# EAGLE design brushless (EAGLE 6.1)

## Sheet 1 of 4
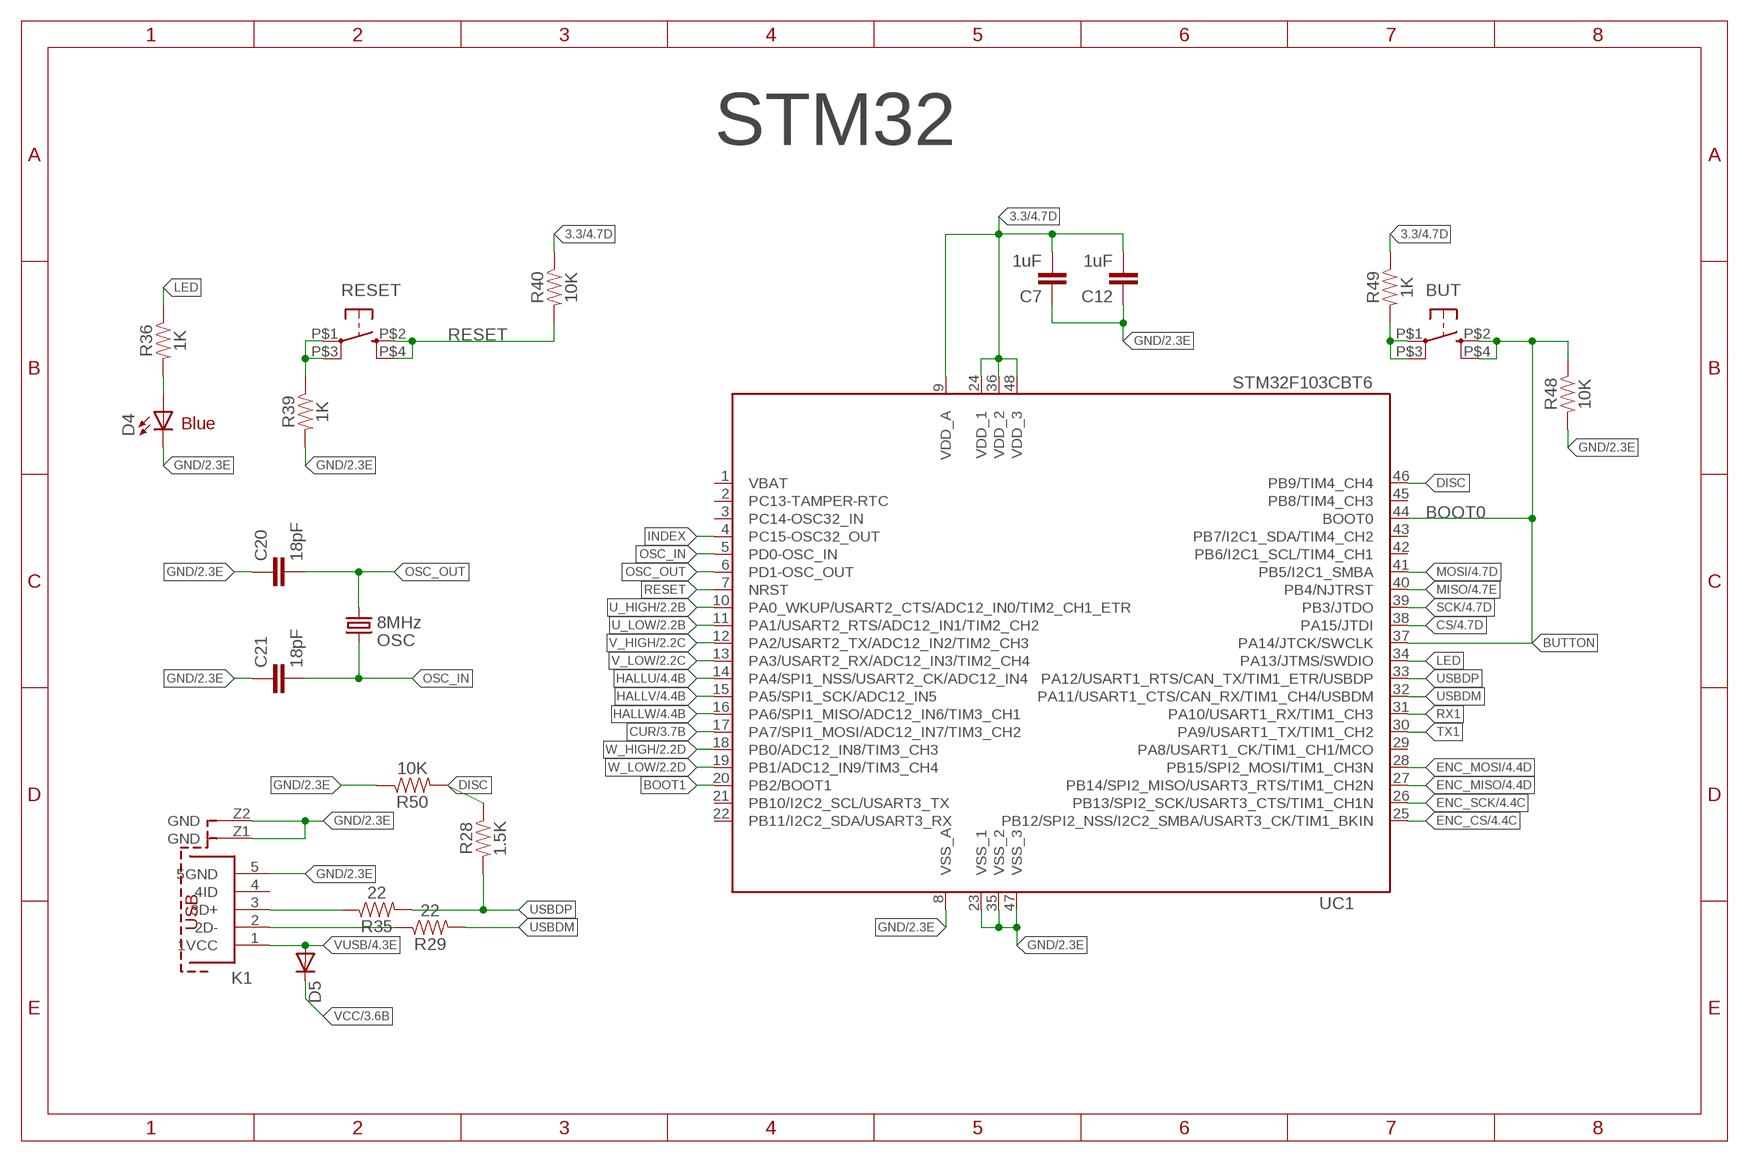
[diagram p0: schematic, sheet 1]

### Parts
BUT  KMR211GLFS  BUTTON-KMR241GLFS  [PUSHBUTTON-KMR241GLFS]
C7  1uF  CAP0805  [0805@1]
C12  1uF  CAP0805  [0805@1]
C20  18pF  CAP0805  [0805@1]
C21  18pF  CAP0805  [0805@1]
D4  Blue  LED1206  [LED-1206]
D5  DIODESOD  [SOD-323]
K1  614105150721  [614105150721]
OSC  8MHz  CRYSTAL5X3  [CRYSTAL-SMD-5X3]
R28  1.5K  RESISTOR0805  [0805]
R29  22  RESISTOR0805  [0805]
R35  22  RESISTOR0805  [0805]
R36  1K  RESISTOR0805  [0805]
R39  1K  RESISTOR0805  [0805]
R40  10K  RESISTOR0805  [0805]
R48  10K  RESISTOR0805  [0805]
R49  1K  RESISTOR0805  [0805]
R50  10K  RESISTOR0805  [0805]
RESET  KMR211GLFS  BUTTON-KMR241GLFS  [PUSHBUTTON-KMR241GLFS]
UC1  STM32F103CBT6  STM32_STM32F103CB  [STM32_LQFP48]

### Nets
3.3: C7.2 C12.2 R40.1 R49.1 UC1.9(VDD_A) UC1.24(VDD_1) UC1.36(VDD_2) UC1.48(VDD_3) ; also sheet 4
BOOT1: UC1.20(PB2/BOOT1)
BUTTON: BUT.P$2 BUT.P$4 R48.1 UC1.37(PA14/JTCK/SWCLK) UC1.44(BOOT0)
CS: UC1.38(PA15/JTDI) ; also sheet 4
CUR: UC1.17(PA7/SPI1_MOSI/ADC12_IN7/TIM3_CH2) ; also sheet 3
DISC: R28.1 R50.2 UC1.46(PB9/TIM4_CH4)
ENC_CS: UC1.25(PB12/SPI2_NSS/I2C2_SMBA/USART3_CK/TIM1_BKIN) ; also sheet 4
ENC_MISO: UC1.27(PB14/SPI2_MISO/USART3_RTS/TIM1_CH2N) ; also sheet 4
ENC_MOSI: UC1.28(PB15/SPI2_MOSI/TIM1_CH3N) ; also sheet 4
ENC_SCK: UC1.26(PB13/SPI2_SCK/USART3_CTS/TIM1_CH1N) ; also sheet 4
GND [power]: C7.1 C12.1 C20.1 C21.1 D4.C K1.5(5GND) K1.Z1(GND) K1.Z2(GND) R39.2 R48.2 R50.1 UC1.8(VSS_A) UC1.23(VSS_1) UC1.35(VSS_2) UC1.47(VSS_3) ; also sheet 2,3,4
HALLU: UC1.14(PA4/SPI1_NSS/USART2_CK/ADC12_IN4) ; also sheet 4
HALLV: UC1.15(PA5/SPI1_SCK/ADC12_IN5) ; also sheet 4
HALLW: UC1.16(PA6/SPI1_MISO/ADC12_IN6/TIM3_CH1) ; also sheet 4
INDEX: UC1.4(PC15-OSC32_OUT)
LED: R36.1 UC1.34(PA13/JTMS/SWDIO)
MISO: UC1.40(PB4/NJTRST) ; also sheet 4
MOSI: UC1.41(PB5/I2C1_SMBA) ; also sheet 4
N$19: R39.1 RESET.P$1 RESET.P$3
N$26: BUT.P$1 BUT.P$3 R49.2
N$29: D4.A R36.2
N$59: K1.2(2D-) R29.1
N$60: K1.3(3D+) R35.1
OSC_IN: C21.2 OSC.3 UC1.5(PD0-OSC_IN)
OSC_OUT: C20.2 OSC.1 UC1.6(PD1-OSC_OUT)
RESET: R40.2 RESET.P$2 RESET.P$4 UC1.7(NRST)
RX1: UC1.31(PA10/USART1_RX/TIM1_CH3)
SCK: UC1.39(PB3/JTDO) ; also sheet 4
TX1: UC1.30(PA9/USART1_TX/TIM1_CH2)
U_HIGH: UC1.10(PA0_WKUP/USART2_CTS/ADC12_IN0/TIM2_CH1_ETR) ; also sheet 2
U_LOW: UC1.11(PA1/USART2_RTS/ADC12_IN1/TIM2_CH2) ; also sheet 2
USBDM: R29.2 UC1.32(PA11/USART1_CTS/CAN_RX/TIM1_CH4/USBDM)
USBDP: R28.2 R35.2 UC1.33(PA12/USART1_RTS/CAN_TX/TIM1_ETR/USBDP)
V_HIGH: UC1.12(PA2/USART2_TX/ADC12_IN2/TIM2_CH3) ; also sheet 2
V_LOW: UC1.13(PA3/USART2_RX/ADC12_IN3/TIM2_CH4) ; also sheet 2
VCC: D5.1(C) ; also sheet 3,4
VUSB: D5.2(A) K1.1(1VCC) ; also sheet 4
W_HIGH: UC1.18(PB0/ADC12_IN8/TIM3_CH3) ; also sheet 2
W_LOW: UC1.19(PB1/ADC12_IN9/TIM3_CH4) ; also sheet 2
Unconnected: K1.4(4ID) UC1.2(PC13-TAMPER-RTC) UC1.3(PC14-OSC32_IN) UC1.21(PB10/I2C2_SCL/USART3_TX) UC1.22(PB11/I2C2_SDA/USART3_RX) UC1.29(PA8/USART1_CK/TIM1_CH1/MCO) UC1.42(PB6/I2C1_SCL/TIM4_CH1) UC1.43(PB7/I2C1_SDA/TIM4_CH2) UC1.45(PB8/TIM4_CH3)

### Notes on the sheet
- STM32
- Blue
- BOOT0

## Sheet 2 of 4
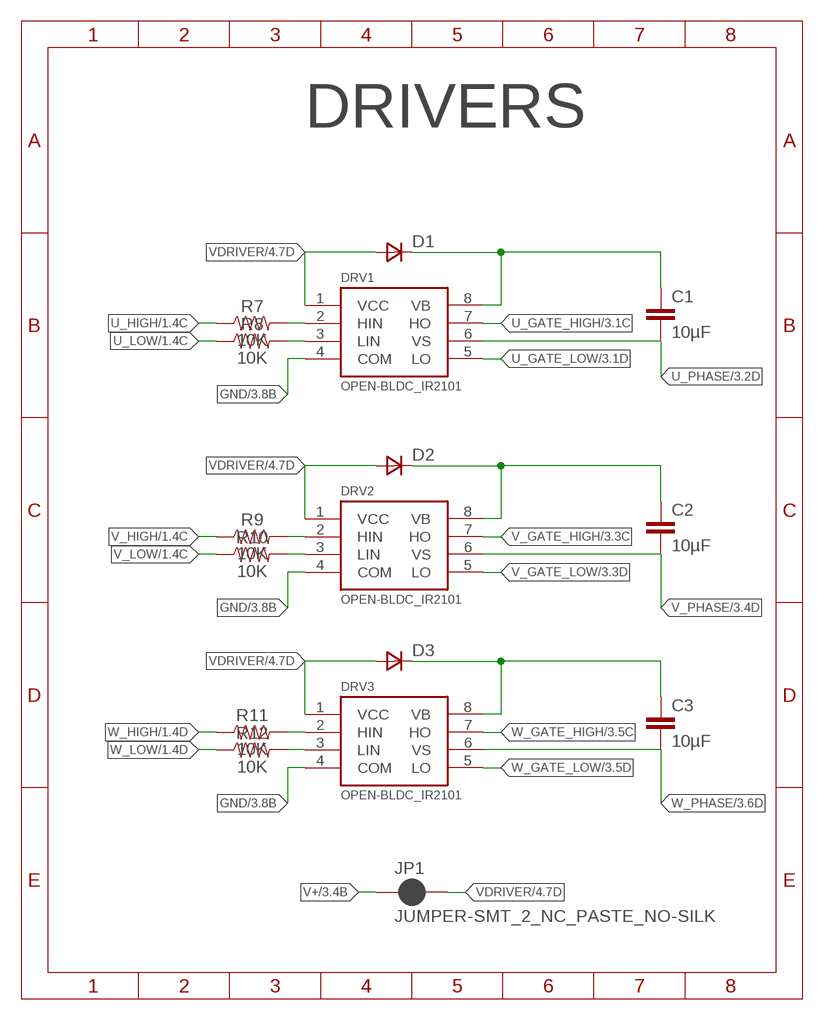
[diagram p1: schematic, sheet 2]

### Parts
C1  10µF  0.33UF/330NF-0805-50V-10%  [0805]
C2  10µF  0.33UF/330NF-0805-50V-10%  [0805]
C3  10µF  0.33UF/330NF-0805-50V-10%  [0805]
D1  ZETEX_VAR2SOT23  [ZETEX_SOT-23]
D2  ZETEX_VAR2SOT23  [ZETEX_SOT-23]
D3  ZETEX_VAR2SOT23  [ZETEX_SOT-23]
DRV1  OPEN-BLDC_IR2101  [OPEN-BLDC_SO-8]
DRV2  OPEN-BLDC_IR2101  [OPEN-BLDC_SO-8]
DRV3  OPEN-BLDC_IR2101  [OPEN-BLDC_SO-8]
JP1  JUMPER-SMT_2_NC_PASTE_NO-SILK  [SMT-JUMPER_2_NC_PASTE_NO-SILK]
R7  10K  RESISTOR0805  [0805]
R8  10K  RESISTOR0805  [0805]
R9  10K  RESISTOR0805  [0805]
R10  10K  RESISTOR0805  [0805]
R11  10K  RESISTOR0805  [0805]
R12  10K  RESISTOR0805  [0805]

### Nets
GND [power]: DRV1.4(COM) DRV2.4(COM) DRV3.4(COM) ; also sheet 1,3,4
N$4: DRV1.2(HIN) R7.2
N$5: C1.1 D1.1(C) DRV1.8(VB)
N$8: DRV1.3(LIN) R8.2
N$10: C2.1 D2.1(C) DRV2.8(VB)
N$12: DRV2.2(HIN) R9.2
N$13: DRV2.3(LIN) R10.2
N$15: C3.1 D3.1(C) DRV3.8(VB)
N$16: DRV3.2(HIN) R11.2
N$17: DRV3.3(LIN) R12.2
U_GATE_HIGH: DRV1.7(HO) ; also sheet 3
U_GATE_LOW: DRV1.5(LO) ; also sheet 3
U_HIGH: R7.1 ; also sheet 1
U_LOW: R8.1 ; also sheet 1
U_PHASE [power]: C1.2 DRV1.6(VS) ; also sheet 3,4
V+ [vdriver]: JP1.1 ; also sheet 3,4
V_GATE_HIGH: DRV2.7(HO) ; also sheet 3
V_GATE_LOW: DRV2.5(LO) ; also sheet 3
V_HIGH: R9.1 ; also sheet 1
V_LOW: R10.1 ; also sheet 1
V_PHASE [power]: C2.2 DRV2.6(VS) ; also sheet 3,4
VDRIVER [vdriver]: D1.3(A) D2.3(A) D3.3(A) DRV1.1(VCC) DRV2.1(VCC) DRV3.1(VCC) JP1.2 ; also sheet 4
W_GATE_HIGH: DRV3.7(HO) ; also sheet 3
W_GATE_LOW: DRV3.5(LO) ; also sheet 3
W_HIGH: R11.1 ; also sheet 1
W_LOW: R12.1 ; also sheet 1
W_PHASE [power]: C3.2 DRV3.6(VS) ; also sheet 3,4

### Notes on the sheet
- DRIVERS

## Sheet 3 of 4
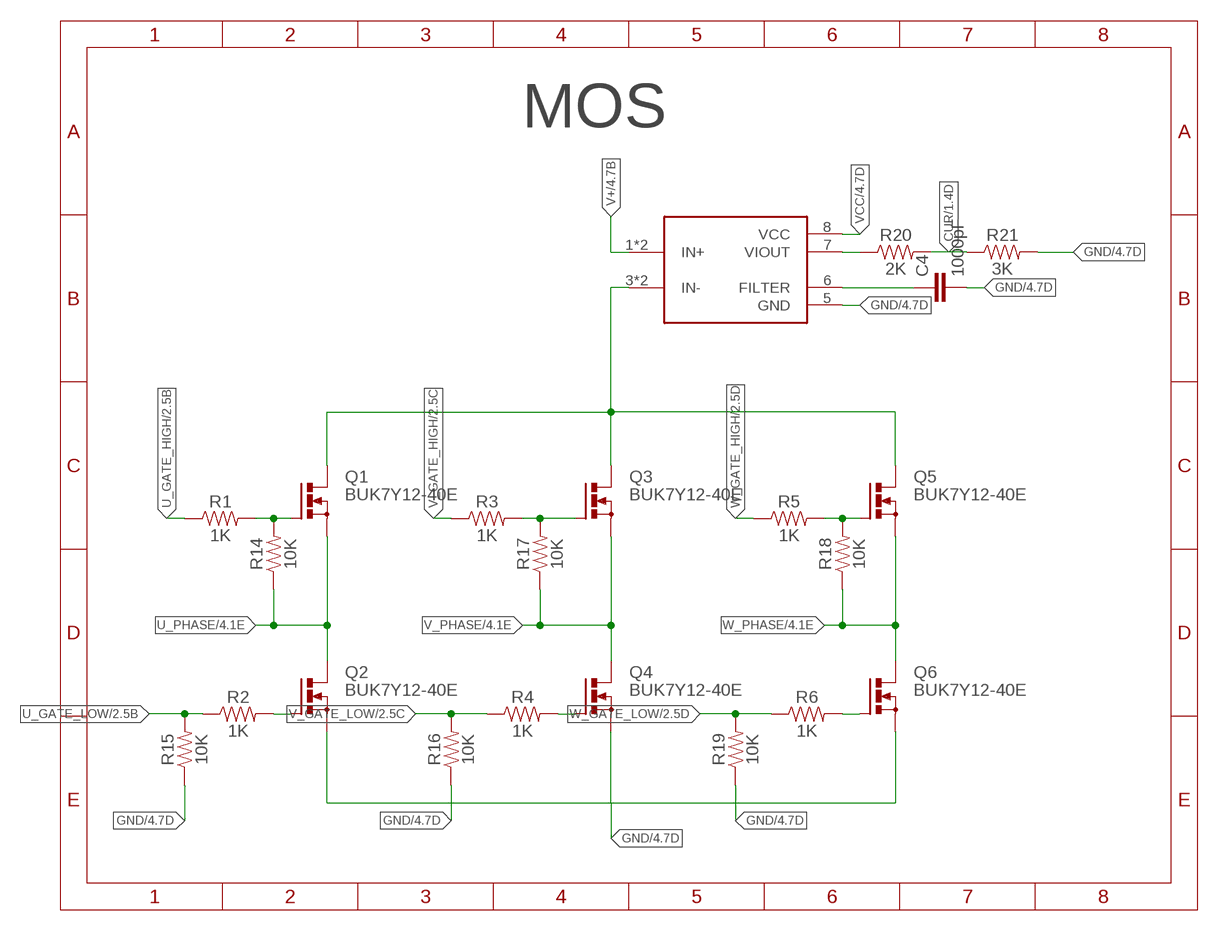
[diagram p2: schematic, sheet 3]

### Parts
C4  1000pF  CAP0805  [0805@1]
Q1  BUK7Y12-40E  [SOT669]
Q2  BUK7Y12-40E  [SOT669]
Q3  BUK7Y12-40E  [SOT669]
Q4  BUK7Y12-40E  [SOT669]
Q5  BUK7Y12-40E  [SOT669]
Q6  BUK7Y12-40E  [SOT669]
R1  1K  RESISTOR0805  [0805]
R2  1K  RESISTOR0805  [0805]
R3  1K  RESISTOR0805  [0805]
R4  1K  RESISTOR0805  [0805]
R5  1K  RESISTOR0805  [0805]
R6  1K  RESISTOR0805  [0805]
R14  10K  RESISTOR0805  [0805]
R15  10K  RESISTOR0805  [0805]
R16  10K  RESISTOR0805  [0805]
R17  10K  RESISTOR0805  [0805]
R18  10K  RESISTOR0805  [0805]
R19  10K  RESISTOR0805  [0805]
R20  2K  RESISTOR0805  [0805]
R21  3K  RESISTOR0805  [0805]
SENSE  ACS712  [SO8]

### Nets
CUR: R20.2 R21.1 ; also sheet 1
GND [power]: C4.2 Q2.1(S) Q2.2(S) Q2.3(S) Q4.1(S) Q4.2(S) Q4.3(S) Q6.1(S) Q6.2(S) Q6.3(S) R15.1 R16.1 R19.1 R21.2 SENSE.5(GND) ; also sheet 1,2,4
N$1: Q1.4(G) R1.2 R14.2
N$2: Q3.4(G) R3.2 R17.2
N$3: Q2.4(G) R2.2
N$6: Q4.4(G) R4.2
N$7: Q5.4(G) R5.2 R18.2
N$9: Q6.4(G) R6.2
N$24: R20.1 SENSE.7(VIOUT)
N$27: C4.1 SENSE.6(FILTER)
U_GATE_HIGH: R1.1 ; also sheet 2
U_GATE_LOW: R2.1 R15.2 ; also sheet 2
U_PHASE [power]: Q1.1(S) Q1.2(S) Q1.3(S) Q2.MB(D) R14.1 ; also sheet 2,4
V+ [vdriver]: SENSE.1(IN+) SENSE.2(IN+) ; also sheet 2,4
V+_MOS [power]: Q1.MB(D) Q3.MB(D) Q5.MB(D) SENSE.3(IN-) SENSE.4(IN-)
V_GATE_HIGH: R3.1 ; also sheet 2
V_GATE_LOW: R4.1 R16.2 ; also sheet 2
V_PHASE [power]: Q3.1(S) Q3.2(S) Q3.3(S) Q4.MB(D) R17.1 ; also sheet 2,4
VCC: SENSE.8(VCC) ; also sheet 1,4
W_GATE_HIGH: R5.1 ; also sheet 2
W_GATE_LOW: R6.1 R19.2 ; also sheet 2
W_PHASE [power]: Q5.1(S) Q5.2(S) Q5.3(S) Q6.MB(D) R18.1 ; also sheet 2,4

### Notes on the sheet
- MOS

## Sheet 4 of 4
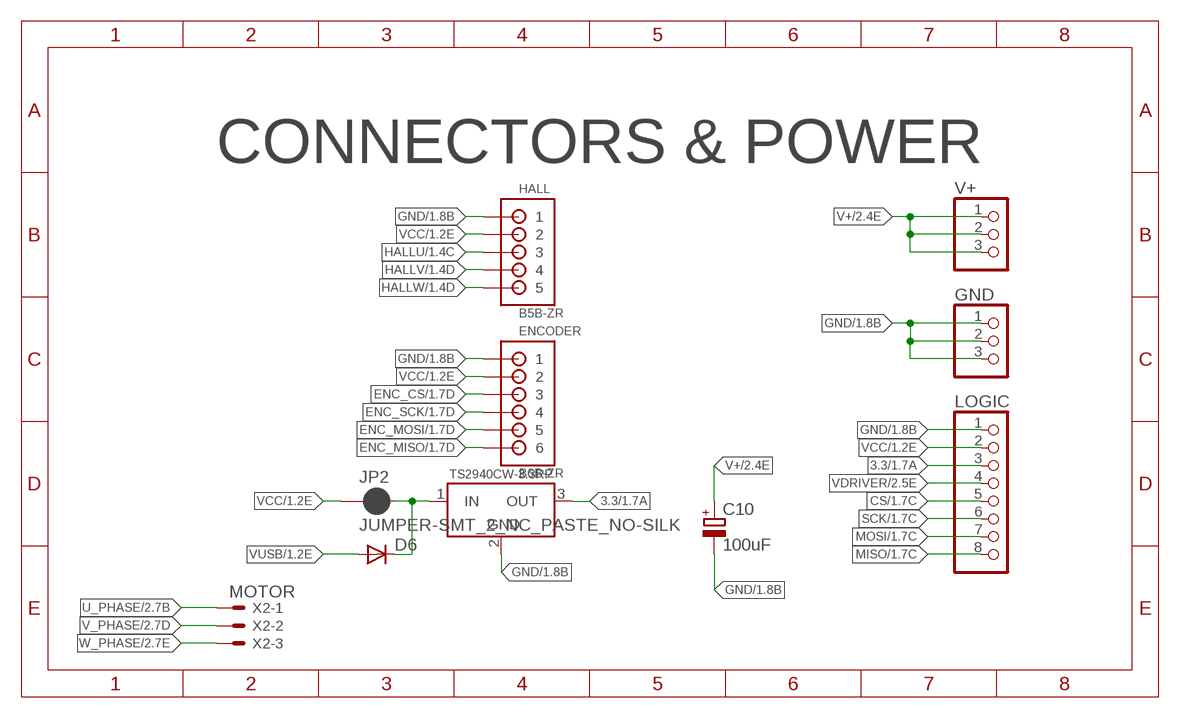
[diagram p3: schematic, sheet 4]

### Parts
C10  100uF  CPOL_EU_3.5-8  [E3,5-8]
D6  DIODESOD  [SOD-323]
ENCODER  B6B-ZR  [B6B-ZR]
GND  CONNEC_1X03  [CONNEC_1X03]
HALL  B5B-ZR  [B5B-ZR]
JP2  JUMPER-SMT_2_NC_PASTE_NO-SILK  [SMT-JUMPER_2_NC_PASTE_NO-SILK]
LOGIC  CONNEC_1X08  [CONNEC_1X08]
REG1  TS2940CW-3.3RP  [SOT223]
V+  CONNEC_1X03  [CONNEC_1X03]
X2  MOTOR  JST-XH-03-PIN-LONG-PAD  [JST-XH-03-PACKAGE-LONG-PAD]

### Nets
3.3: LOGIC.3 REG1.3(OUT) ; also sheet 1
CS: LOGIC.5 ; also sheet 1
ENC_CS: ENCODER.3 ; also sheet 1
ENC_MISO: ENCODER.6 ; also sheet 1
ENC_MOSI: ENCODER.5 ; also sheet 1
ENC_SCK: ENCODER.4 ; also sheet 1
GND [power]: C10.- ENCODER.1 GND.1 GND.2 GND.3 HALL.1 LOGIC.1 REG1.2(GND) ; also sheet 1,2,3
HALLU: HALL.3 ; also sheet 1
HALLV: HALL.4 ; also sheet 1
HALLW: HALL.5 ; also sheet 1
MISO: LOGIC.8 ; also sheet 1
MOSI: LOGIC.7 ; also sheet 1
N$22: D6.1(C) JP2.2 REG1.1(IN)
SCK: LOGIC.6 ; also sheet 1
U_PHASE [power]: X2.1 ; also sheet 2,3
V+ [vdriver]: C10.+ V+.1 V+.2 V+.3 ; also sheet 2,3
V_PHASE [power]: X2.2 ; also sheet 2,3
VCC: ENCODER.2 HALL.2 JP2.1 LOGIC.2 ; also sheet 1,3
VDRIVER [vdriver]: LOGIC.4 ; also sheet 2
VUSB: D6.2(A) ; also sheet 1
W_PHASE [power]: X2.3 ; also sheet 2,3

### Notes on the sheet
- CONNECTORS & POWER

## Power pins joined to a net without a drawn wire
VBAT: UC1.1(VBAT)

## Library data of the parts
BUT RESET = okie:BUTTON-KMR241GLFS; FARNELL: 1437637
C1-C3 = SparkFun-Capacitors:0.33UF/330NF: 0.33µF/330nF ceramic capacitors A capacitor is a passive two-terminal electrical component used to store electrical energy temporarily in an electric field.; FARNELL: 2528772; PROD_ID: CAP-08469; VALUE: 0.33µF
C4 = SparkFun-Passives:CAP: Capacitor Standard 0603 ceramic capacitor, and 0.1" leaded capacitor.; FARNELL: 2496935
C7 C12 = SparkFun-Passives:CAP: Capacitor Standard 0603 ceramic capacitor, and 0.1" leaded capacitor.; FARNELL: 2496946
C10 = rhoban:CPOL_EU: 47uF: http://fr.farnell.com/panasonic-electronic-components/eee1ca470sp/condensateur-elec-alu-47uf-16v/dp/9696946 220uF: http://fr.farnell.com/panasonic-electronic-components/eeefk1c221xp/condensateur-elec-alu-220uf-16v/dp/1850103; FARNELL: 1870964
C20 C21 = SparkFun-Passives:CAP: Capacitor Standard 0603 ceramic capacitor, and 0.1" leaded capacitor.; FARNELL: 1414620
D1-D3 = rhoban:ZETEX_VAR2SOT23: DIODE; FARNELL: 2317446
D4 = SparkFun:LED: LEDs Standard schematic elements and footprints for 5mm, 3mm, 1206, and 0603 sized LEDs. 5mm - Spark Fun Electronics SKU : COM-00529 (and others); FARNELL: 1581233
D5 D6 = SparkFun-DiscreteSemi:DIODE: Diode These are standard reverse protection diodes and small signal diodes. SMA package can handle up to about 1A. SOD-323 can handle about 200mA. What the SOD-323 package when ordering, there are some mfgs out there that are 5-pin packages.; FARNELL: 8737843RL
DRV1-DRV3 = rhoban:OPEN-BLDC_IR2101; FARNELL: 8638730
ENCODER = jst:B6B-ZR: JST-ZH Connector 6 pol, 1.5mm pitch Package: B6B-ZR Source: http://www.jst-mfg.com/product/pdf/eng/eZH.pdf; FARNELL: -
GND V+ = rhoban:CONNEC_1X03; FARNELL: 1022248
HALL = jst:B5B-ZR: JST-ZH Connector 5 pol, 1.5mm pitch Package: B5B-ZR Source: http://www.jst-mfg.com/product/pdf/eng/eZH.pdf; FARNELL: -
JP1 JP2 = SparkFun-Jumpers:JUMPER-SMT_2_NC_PASTE: Normally closed solder jumper This jumper has an aperture in the stencil to allow solder paste to bridge the split in the wire so it's normally closed (NC). Wick off the solder to open the connection. Reapply solder to reclose the connection.; FARNELL: -
K1 = rhoban:614105150721: WR-COM_USB_Micro Type B_Vertical_THT; Micro Type B Vertical THT- Tape & Reel not for Pick & Place machine Code : Con_I-O_COM_USB_2.0_B_614105150721_614105150721 <http://katalog.we-online.de/media/images/eican/Con_I-O_COM_USB_2.0_B_614105150721_pf2.jpg> Details see: http://katalog.we-online.de/em/datasheet/614105150721.pdf Created 12/08/2014, Dan Xu 2014 (C) Wurth Elektronik; FARNELL: 2470821
LOGIC = rhoban:CONNEC_1X08; FARNELL: 1022256
OSC = SparkFun2:CRYSTAL: Crystals Various standard crystals. Proven footprints. Spark Fun Electronics SKU : COM-00534; FARNELL: 2467818
Q1-Q6 = transistor-power:BUK7Y12-40E; FARNELL: 2319916
R1-R6 R36 R39 R49 = SparkFun-Resistors:RESISTOR: Generic Resistor Package; FARNELL: 2446904
R7-R12 R14-R19 R40 R48 R50 = SparkFun-Resistors:RESISTOR: Generic Resistor Package; FARNELL: 2447553
R20 = SparkFun-Resistors:RESISTOR: Generic Resistor Package; FARNELL: 2446939
R21 = SparkFun-Resistors:RESISTOR: Generic Resistor Package; FARNELL: 2446965
R28 = SparkFun-Resistors:RESISTOR: Generic Resistor Package; FARNELL: 2446909
R29 R35 = SparkFun-Resistors:RESISTOR: Generic Resistor Package; FARNELL: 2446926
REG1 = rhoban:TS2940CW-3.3RP; FARNELL: 7261403
SENSE = rhoban:ACS712; FARNELL: 1329624
UC1 = rhoban:STM32_STM32F103CB; FARNELL: 1606327
X2 = Rembrandt Electronics - JST XH Connectors v1-0:JST-XH-03-PIN: JST XH Connector 2 Pin Wire to board connector. Pitch: 2,54 mm, (0.100") Number of pins: 3 Created by Rembrandt Electronics www.rembrandtelectronics.com; FARNELL: -

## Net classes
1 vdriver: width 0.254 mm

## Board
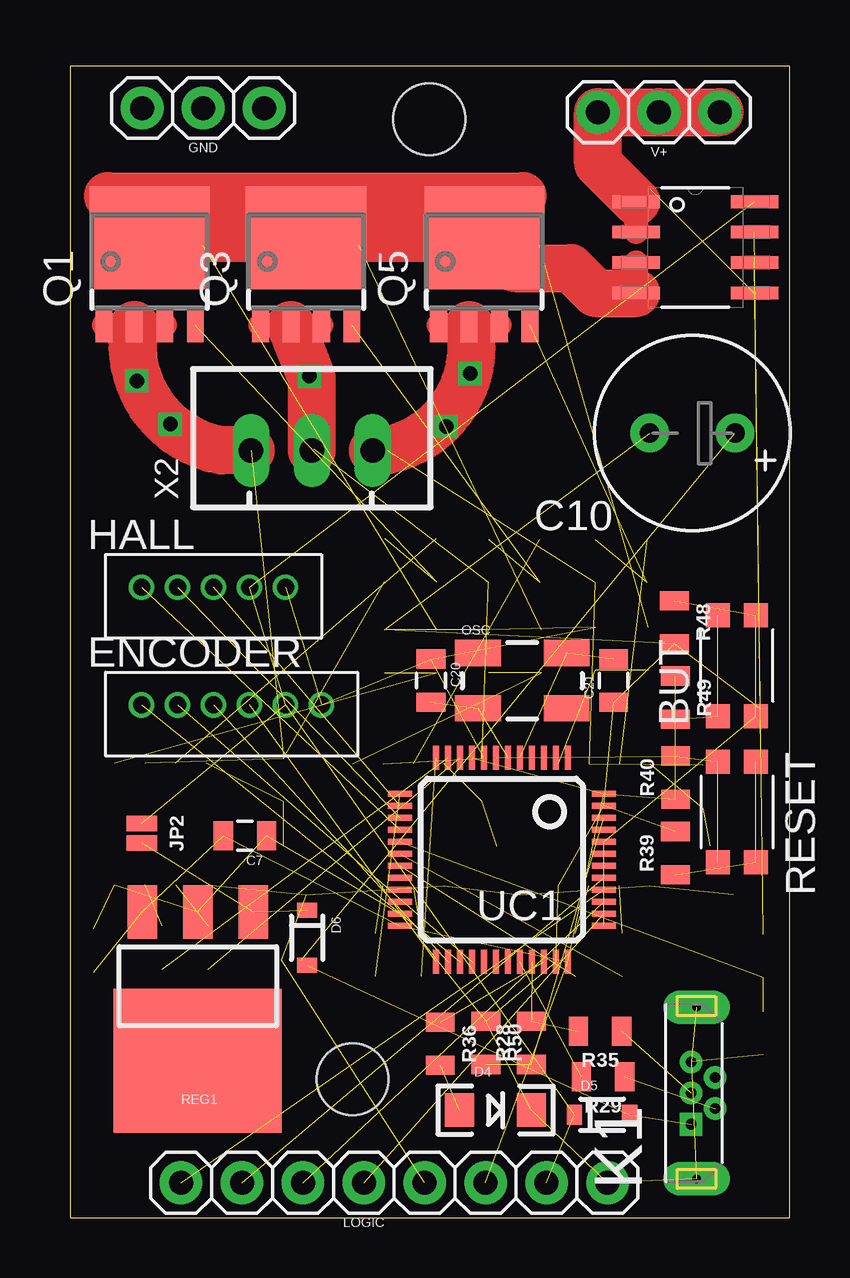
[diagram p4: board, top side]
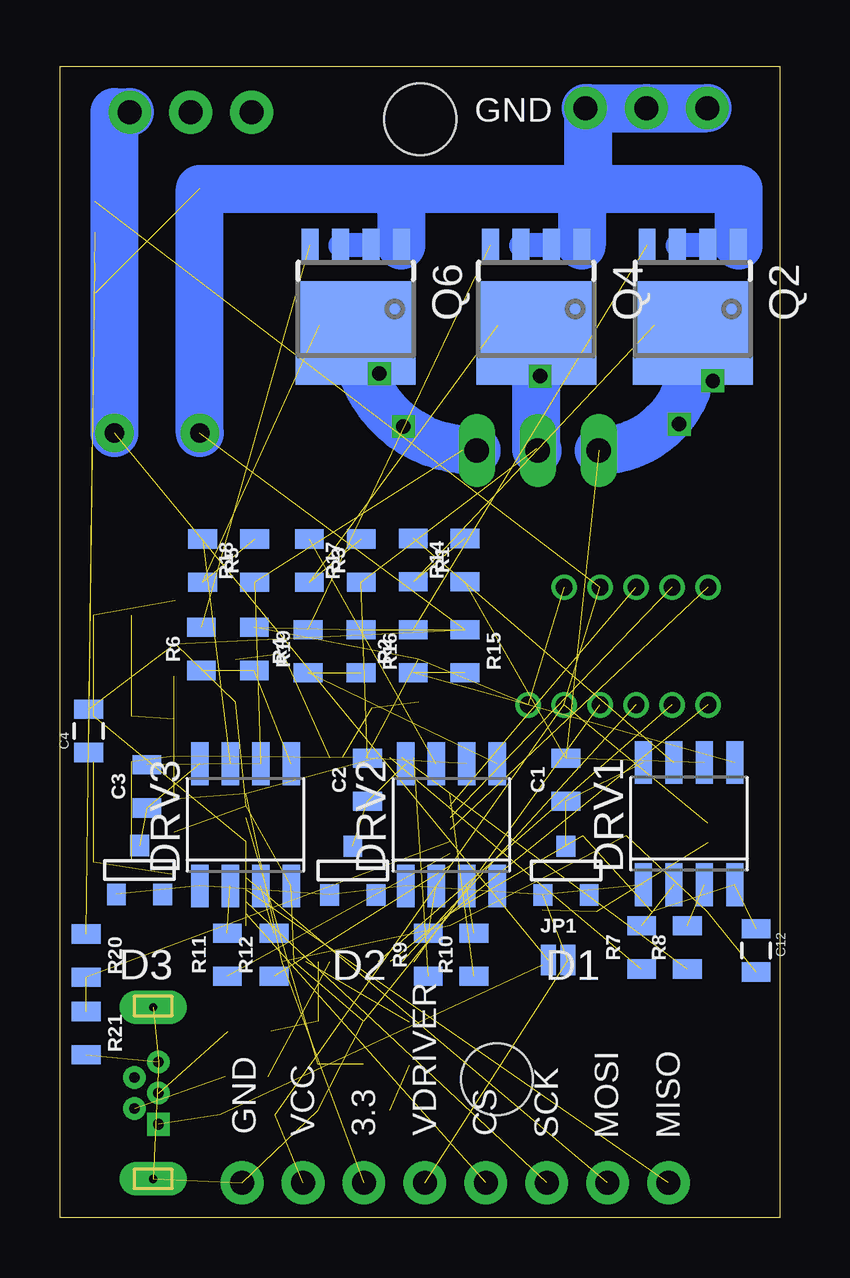
[diagram p5: board, bottom side, seen from below]

Size 30 x 47.97 mm. Coordinates in mm from the lower left corner, seen from the top.
Outline: 0,0 30,0 30,47.97 0,47.97 0,0
Copper layers (1*2*15*16): Top 0.035559375mm / dielectric 0.47751875mm / Route2 0.035559375mm / dielectric 0.47751875mm / Route15 0.035559375mm / dielectric 0.47751875mm / Bottom 0.035559375mm
Design rules: minimum track width 7mil, minimum drill 15mil, track to track 7mil, track to pad 7mil, pad to pad 7mil, via to via 7mil, smd to smd 7mil, copper to edge 7mil, drill to drill 7mil, minimum pad ring 7mil, minimum via ring 7mil, stop-mask expansion 4mil, vias tented up to drill 25mil, thermal gap 10mil
Holes 3 mm at 14.98,45.77 11.78,5.77
tRestrict: area 13.1,43.9 to 16.9,47.7; area 9.9,3.9 to 13.7,7.7
bRestrict: area 13.1,43.9 to 16.9,47.7

### Footprints (pad centres in the part's own frame; a part is rotated, then mirrored left to right if it is on the bottom)
PUSHBUTTON-KMR241GLFS = smd 1 x 1: P$1 2.1,0.8; P$2 2.1,-0.8; P$3 -2.1,0.8; P$4 -2.1,-0.8
0805 = smd 0.8 x 1.2: 1 -0.9,0; 2 0.9,0
0805@1 = smd 0.8 x 1.2: 1 -0.9,0; 2 0.9,0
E3,5-8 = drill 0.813 pad 1.6: + -1.778,0; - 1.778,0
ZETEX_SOT-23 = smd 0.787 x 0.889: 1 0.025,-1.016; 2 -0.94,1.016; 3 0.991,1.016
LED-1206 = smd 1.2 x 1.4: A -1.5,0; C 1.5,0
SOD-323 = smd 0.63 x 0.83: 1 -1.15,0; 2 1.15,0
OPEN-BLDC_SO-8 = smd 0.72 x 1.78: 1 -1.905,-2.543; 2 -0.635,-2.543; 3 0.635,-2.543; 4 1.905,-2.543; 5 1.905,2.543; 6 0.635,2.543; 7 -0.635,2.543; 8 -1.905,2.543
B6B-ZR = drill 0.7: 1 9,-1.3; 2 7.5,-1.3; 3 6,-1.3; 4 4.5,-1.3; 5 3,-1.3; 6 1.5,-1.3
CONNEC_1X03 = drill 1 pad 1.778: 1 -1.27,1.27; 2 1.27,1.27; 3 3.81,1.27
B5B-ZR = drill 0.7: 1 7.5,-1.3; 2 6,-1.3; 3 4.5,-1.3; 4 3,-1.3; 5 1.5,-1.3
SMT-JUMPER_2_NC_PASTE_NO-SILK = smd 0.635 x 1.27: 1 -0.406,0; 2 0.406,0
614105150721 = drill 0.44 pad 0.94 square: 1 2.275,0.22 | drill 0.44 pad 0.94: 2 2.925,-0.78; 3 3.575,0.22; 4 4.225,-0.78; 5 4.875,0.22 | drill 0.35 pad 1.4 long: Z1 0,0; Z2 7.15,0
CONNEC_1X08 = drill 1 pad 1.778: 1 -10.16,0; 2 -7.62,0; 3 -5.08,0; 4 -2.54,0; 5 0,0; 6 2.54,0; 7 5.08,0; 8 7.62,0
CRYSTAL-SMD-5X3 = smd 1.9 x 1.1: 1 -1.85,-1.15; 2 1.85,-1.15; 3 1.85,1.15; 4 -1.85,1.15
SOT669 = smd 0.7 x 1.4: 1 -1.905,-2.65; 2 -0.635,-2.65; 3 0.635,-2.65; 4 1.905,-2.65 | smd 5 x 4.3: MB 0,1
SOT223 = smd 1.219 x 2.235: 1 -2.311,-3.099; 2 0,-3.099; 3 2.311,-3.099 | smd 7 x 6: 4 0,3.099
SO8 = smd 1.981 x 0.533: 1 -2.464,1.905; 2 -2.464,0.635; 3 -2.464,-0.635; 4 -2.464,-1.905; 5 2.464,-1.905; 6 2.464,-0.635; 7 2.464,0.635; 8 2.464,1.905
STM32_LQFP48 = smd 0.25 x 1: 1 -2.75,-4.25; 2 -2.25,-4.25; 3 -1.75,-4.25; 4 -1.25,-4.25; 5 -0.75,-4.25; 6 -0.25,-4.25; 7 0.25,-4.25; 8 0.75,-4.25; 9 1.25,-4.25; 10 1.75,-4.25; 11 2.25,-4.25; 12 2.75,-4.25; 25 2.75,4.25; 26 2.25,4.25; 27 1.75,4.25; 28 1.25,4.25; 29 0.75,4.25; 30 0.25,4.25; 31 -0.25,4.25; 32 -0.75,4.25; 33 -1.25,4.25; 34 -1.75,4.25; 35 -2.25,4.25; 36 -2.75,4.25 | smd 1 x 0.25: 13 4.25,-2.75; 14 4.25,-2.25; 15 4.25,-1.75; 16 4.25,-1.25; 17 4.25,-0.75; 18 4.25,-0.25; 19 4.25,0.25; 20 4.25,0.75; 21 4.25,1.25; 22 4.25,1.75; 23 4.25,2.25; 24 4.25,2.75; 37 -4.25,2.75; 38 -4.25,2.25; 39 -4.25,1.75; 40 -4.25,1.25; 41 -4.25,0.75; 42 -4.25,0.25; 43 -4.25,-0.25; 44 -4.25,-0.75; 45 -4.25,-1.25; 46 -4.25,-1.75; 47 -4.25,-2.25; 48 -4.25,-2.75
JST-XH-03-PACKAGE-LONG-PAD = drill 1.016 long: 1 -2.54,0; 2 0,0; 3 2.54,0

### Placement (x,y rotation side)
BUT  27.8,23 90 top
C1  8.9,18.25 90 bottom
C2  17.18,18.25 90 bottom
C3  26.38,17.97 90 bottom
C4  28.8,20.28 90 bottom
C7  1uF  [0805]  7.29,15.91 180 top
C10  25.94,32.7 180 top
C12  1uF  [0805]  0.98,11.14 270 bottom
C20  18pF  [0805]  15.05,22.38 270 top
C21  18pF  [0805]  22.67,22.38 90 top
D1  8.88,14.46 180 bottom
D2  17.77,14.46 180 bottom
D3  26.66,14.49 180 bottom
D4  17.74,4.48 0 top
D5  22.18,4.29 0 top
D6  9.88,11.67 270 top
DRV1  3.77,16.42 0 bottom
DRV2  13.68,16.37 0 bottom
DRV3  22.26,16.37 0 bottom
ENCODER  1.48,22.67 0 top
GND  6.82,47.51 180 top
HALL  1.48,27.57 0 top
JP1  9.22,10.73 0 bottom
JP2  2.99,16.02 270 top
K1  26.11,1.62 90 top
LOGIC  12.25,1.46 180 top
OSC  18.86,22.38 0 top
Q1  3.32,39.84 0 top
Q2  3.62,37.86 180 bottom
Q3  9.85,39.84 0 top
Q4  10.14,37.86 180 bottom
Q5  17.27,39.84 0 top
Q6  17.67,37.86 180 bottom
R1  15.27,27.4 270 bottom
R2  15.27,23.6 90 bottom
R3  19.6,27.38 270 bottom
R4  19.65,23.6 90 bottom
R5  24.05,27.38 270 bottom
R6  24.1,23.7 90 bottom
R7  5.75,11.26 90 bottom
R8  3.85,11.26 90 bottom
R9  14.64,10.96 90 bottom
R10  12.74,10.96 90 bottom
R11  23.02,10.96 90 bottom
R12  21.07,10.96 90 bottom
R14  13.11,27.4 90 bottom
R15  13.12,23.6 270 bottom
R16  17.45,23.6 270 bottom
R17  17.44,27.38 90 bottom
R18  21.89,27.38 90 bottom
R19  21.9,23.7 270 bottom
R20  28.91,10.92 270 bottom
R21  28.91,7.69 270 bottom
R28  19.24,7.29 90 top
R29  22.22,5.87 180 top
R35  22.1,7.78 180 top
R36  15.44,7.25 270 top
R39  25.23,15.19 90 top
R40  25.25,18.34 90 top
R48  25.2,24.81 270 top
R49  25.23,21.67 270 top
R50  17.34,7.29 270 top
REG1  5.33,9.64 180 top
RESET  27.8,16.91 270 top
SENSE  26.07,40.43 0 top
UC1  18,14.92 180 top
V+  25.82,47.33 180 top
X2  10.08,31.97 0 top

### Tracks (layer width: path | path; a pad name or v marks a point on that pad's centre or on a via)
3.3  (9 unrouted)
BUTTON  (4 unrouted)
CS  (1 unrouted)
CUR  (2 unrouted)
DISC  (2 unrouted)
ENC_CS  (1 unrouted)
ENC_MISO  (1 unrouted)
ENC_MOSI  (1 unrouted)
ENC_SCK  (1 unrouted)
GND  (28 unrouted)
  Bottom 1: Q2.3 Q2.2 Q2.1 | Q4.3 Q4.2 Q4.1 | Q6.1 Q6.2 Q6.3
  Bottom 2: GND.3 GND.2 GND.1 7.98,46.24 7.98,42.87 | 7.98,42.87 1.72,42.87 Q2.1 | 7.98,42.87 8.24,42.87 | 8.24,42.87 Q4.1 | Q6.1 15.77,42.87 | 15.77,42.87 8.24,42.87 | C10.- 24.17,42.87 15.77,42.87
HALLU  (1 unrouted)
HALLV  (1 unrouted)
HALLW  (1 unrouted)
LED  (1 unrouted)
MISO  (1 unrouted)
MOSI  (1 unrouted)
N$1  (2 unrouted)
N$2  (2 unrouted)
N$3  (1 unrouted)
N$4  (1 unrouted)
N$5  (2 unrouted)
N$6  (1 unrouted)
N$7  (2 unrouted)
N$8  (1 unrouted)
N$9  (1 unrouted)
N$10  (2 unrouted)
N$11  (via drill 0.6)
  other vias: 4.18,33.07
N$12  (1 unrouted)
N$13  (1 unrouted)
N$14  (via drill 0.6)
  other vias: 15.68,32.97
N$15  (2 unrouted)
N$16  (1 unrouted)
N$17  (1 unrouted)
N$18
  Top 2: 1.58,42.57 18.88,42.57
N$19  (2 unrouted)
N$20  (via drill 0.6)
  other vias: 9.98,35.07
N$21  (via drill 0.6)
  other vias: 2.78,34.87
N$22  (2 unrouted)
N$23  (via drill 0.6)
  other vias: 16.68,35.17
N$24  (1 unrouted)
N$26  (2 unrouted)
N$27  (1 unrouted)
N$29  (1 unrouted)
N$59  (1 unrouted)
N$60  (1 unrouted)
OSC_IN  (2 unrouted)
OSC_OUT  (2 unrouted)
RESET  (3 unrouted)
SCK  (1 unrouted)
U_GATE_HIGH  (1 unrouted)
U_GATE_LOW  (2 unrouted)
U_HIGH  (1 unrouted)
U_LOW  (1 unrouted)
U_PHASE  (3 unrouted)
  Top 1: Q1.3 Q1.2 Q1.1
  Top 2: X2.1 6.3,31.97 arc-90 Q1.2
  Bottom 2: X2.1 arc-90 3.62,35.89 Q2.MB
USBDM  (1 unrouted)
USBDP  (2 unrouted)
V+  (1 unrouted)
  Top 1: SENSE.2 SENSE.1
  Top 2: SENSE.1 22.01,43.93 V+.3 V+.2 V+.1
  Bottom 2: C10.+ 27.72,46.06 V+.1
V+_MOS
  Top 1: SENSE.4 SENSE.3
  Top 2: Q1.MB Q3.MB Q5.MB 18.54,39.57 20.88,39.57 21.92,38.53 SENSE.4
V_GATE_HIGH  (1 unrouted)
V_GATE_LOW  (2 unrouted)
V_HIGH  (1 unrouted)
V_LOW  (1 unrouted)
V_PHASE  (3 unrouted)
  Top 1: Q3.1 Q3.2 Q3.3
  Top 2: X2.2 10.08,34.97 Q3.2
  Bottom 2: X2.2 arc90 10.14,32.03 Q4.MB
VCC  (5 unrouted)
VDRIVER  (7 unrouted)
VUSB  (2 unrouted)
W_GATE_HIGH  (1 unrouted)
W_GATE_LOW  (2 unrouted)
W_HIGH  (1 unrouted)
W_LOW  (1 unrouted)
W_PHASE  (3 unrouted)
  Top 1: Q5.1 Q5.2 Q5.3
  Top 2: Q5.2 arc-90 13.21,31.97 X2.3
  Bottom 2: X2.3 12.78,31.97 arc90 Q6.MB

### Text on the board
bNames: GND | GND | MISO | MOSI | SCK | CS | VDRIVER | 3.3 | VCC